# EAGLE design ridici2 (EAGLE 4.11)
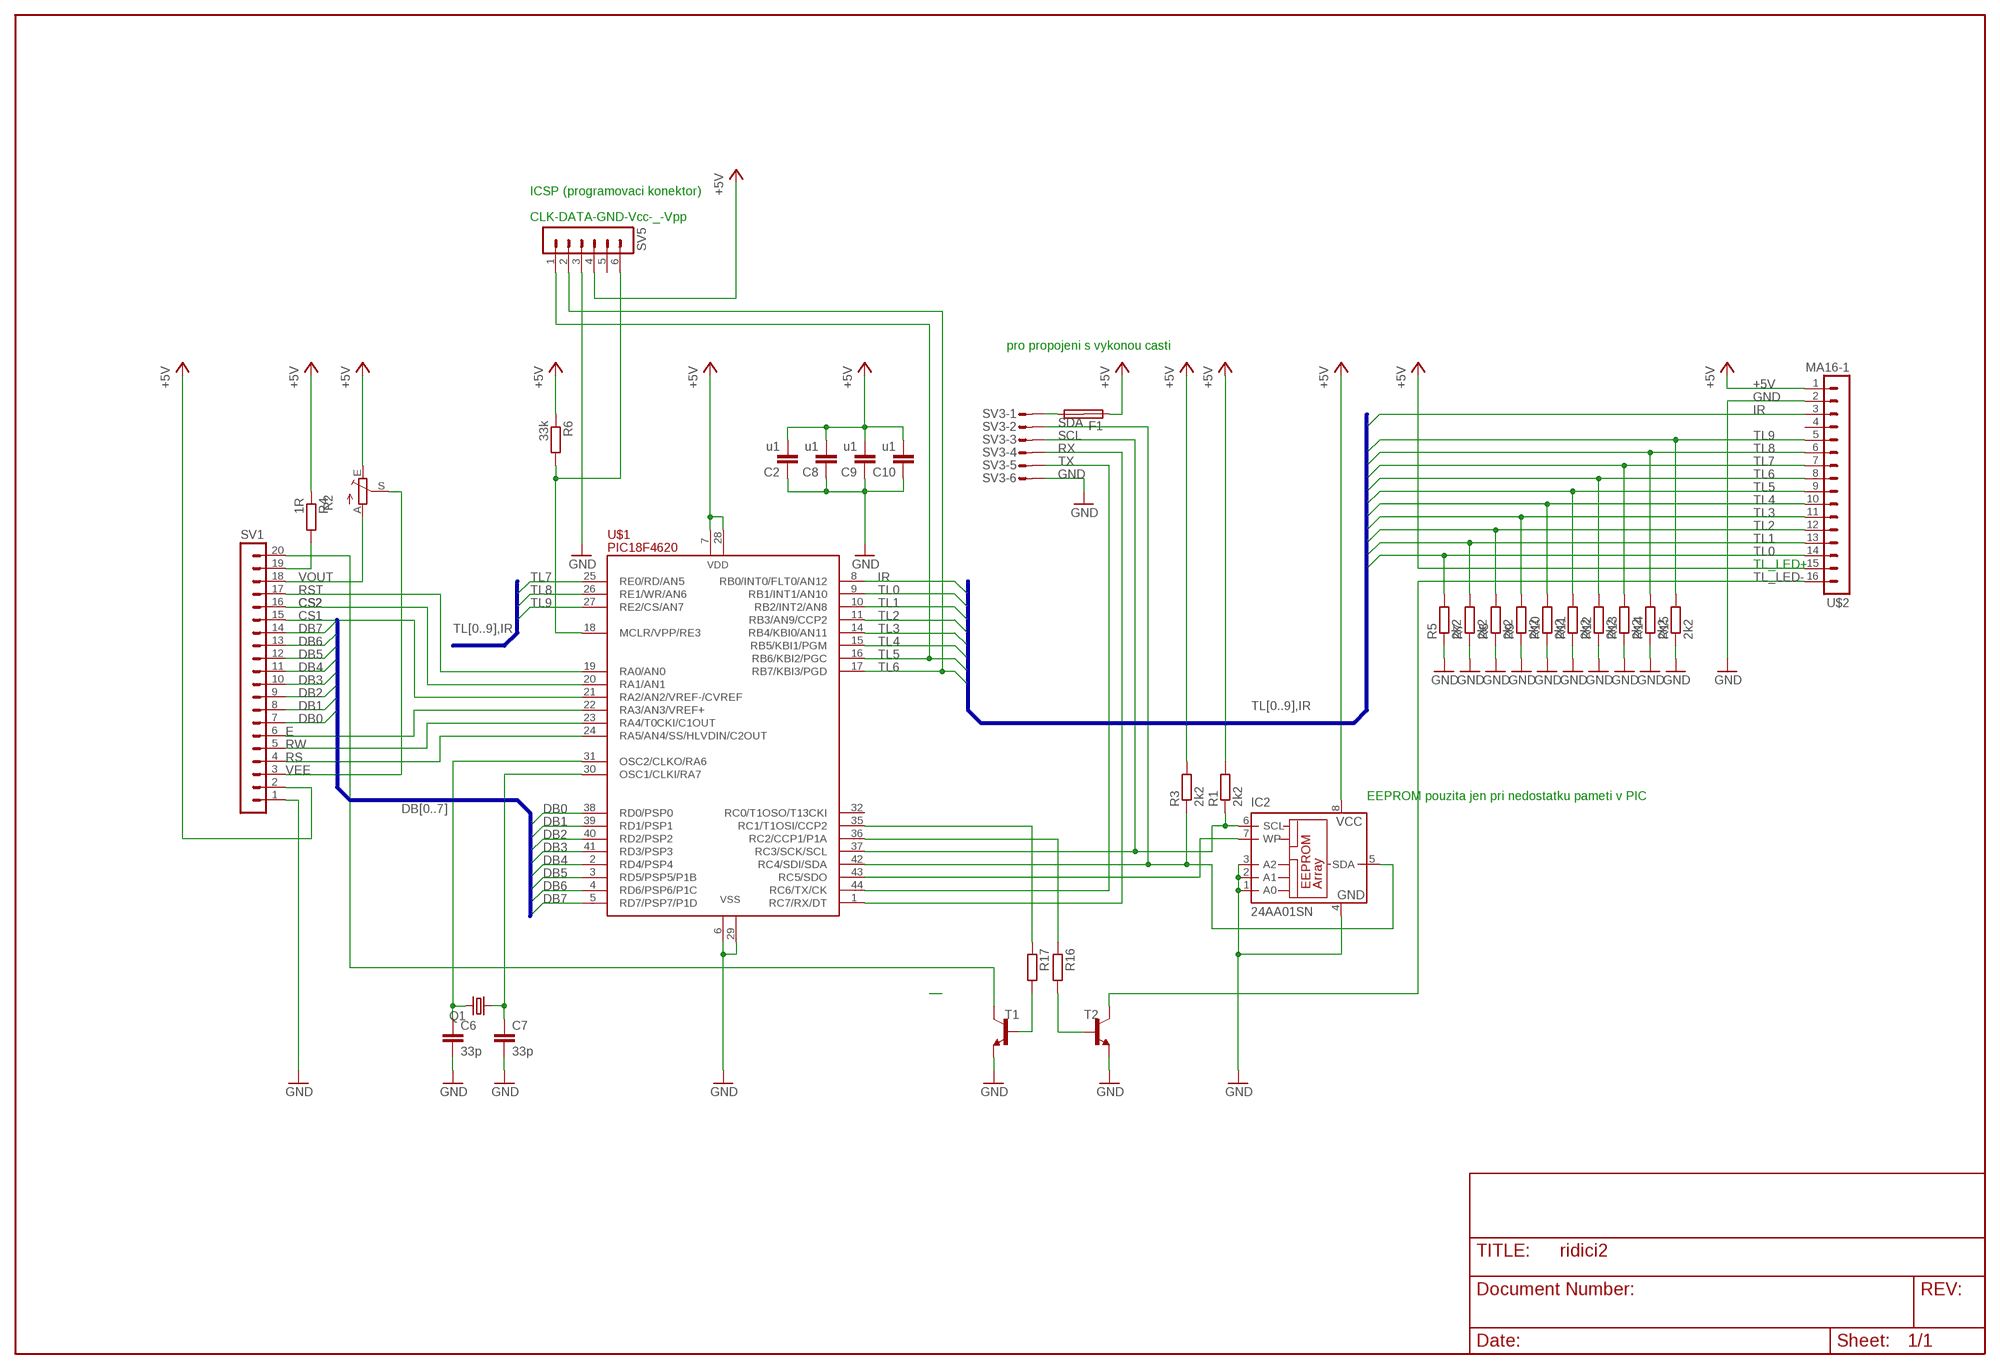
[diagram p0: schematic, sheet 1]

## Parts
C2  u1  C-EUC1206  [C1206]
C6  33p  C-EUC1206  [C1206]
C7  33p  C-EUC1206  [C1206]
C8  u1  C-EUC1206  [C1206]
C9  u1  C-EUC1206  [C1206]
C10  u1  C-EUC1206  [C1206]
F1  SHK20L  [SHK20L]
IC2  24AA01SN  [SO-08]
Q1  CRYTALHC18U-V  [HC18U-V]
R1  2k2  R-EU_0207/10  [0207/10]
R2  TRIM_EU-PT10S  [PT-10S]
R3  2k2  R-EU_0207/10  [0207/10]
R4  1R  R-EU_R1206  [R1206]
R5  2k2  R-EU_0207/10  [0207/10]
R6  33k  R-EU_R1206  [R1206]
R7  2k2  R-EU_0207/10  [0207/10]
R8  2k2  R-EU_0207/10  [0207/10]
R9  2k2  R-EU_0207/10  [0207/10]
R10  2k2  R-EU_0207/10  [0207/10]
R11  2k2  R-EU_0207/10  [0207/10]
R12  2k2  R-EU_0207/10  [0207/10]
R13  2k2  R-EU_0207/10  [0207/10]
R14  2k2  R-EU_0207/10  [0207/10]
R15  2k2  R-EU_0207/10  [0207/10]
R16  R-EU_0207/10  [0207/10]
R17  R-EU_R1206  [R1206]
SV1  MA20-1  [MA20-1]
SV3  L06P  [L06P]
SV5  MA06-1  [MA06-1]
T1  -NPN-SOT23-EBC  [SOT23-EBC]
T2  -NPN-SOT23-EBC  [SOT23-EBC]
U$1  PIC18F4620  [TQFP44]
U$2  MA16-1  [MA16-1]

## Nets
+5V: C2.2 C8.2 C9.2 C10.2 F1.1A IC2.8(VCC) R1.2 R2.E R3.2 R4.1 R6.1 SV1.2 SV5.4 U$1.7(VDD) U$1.28(VDD) U$2.1 U$2.15
CCP1: R16.1 U$1.36(RC2/CCP1/P1A)
CCP2: R17.1 U$1.35(RC1/T1OSI/CCP2)
CS1: SV1.15 U$1.21(RA2/AN2/VREF-/CVREF)
CS2: SV1.16 U$1.20(RA1/AN1)
DB0: SV1.7 U$1.38(RD0/PSP0)
DB1: SV1.8 U$1.39(RD1/PSP1)
DB2: SV1.9 U$1.40(RD2/PSP2)
DB3: SV1.10 U$1.41(RD3/PSP3)
DB4: SV1.11 U$1.2(RD4/PSP4)
DB5: SV1.12 U$1.3(RD5/PSP5/P1B)
DB6: SV1.13 U$1.4(RD6/PSP6/P1C)
DB7: SV1.14 U$1.5(RD7/PSP7/P1D)
E: SV1.6 U$1.22(RA3/AN3/VREF+)
GND: C2.1 C6.2 C7.2 C8.1 C9.1 C10.1 IC2.1(A0) IC2.2(A1) IC2.3(A2) IC2.4(GND) R5.1 R7.1 R8.1 R9.1 R10.1 R11.1 R12.1 R13.1 R14.1 R15.1 SV1.1 SV3.6 SV5.3 T1.E T2.E U$1.6(VSS) U$1.29(VSS) U$2.2
IR: U$1.8(RB0/INT0/FLT0/AN12) U$2.3
N$1: F1.2A SV3.1
N$5: R4.2 SV1.19
N$6: C7.1 Q1.1 U$1.30(OSC1/CLKI/RA7)
N$7: C6.1 Q1.2 U$1.31(OSC2/CLKO/RA6)
N$10: IC2.7(WP) U$1.43(RC5/SDO)
N$13: SV1.20 T1.C
N$14: R6.2 SV5.6 U$1.18(MCLR/VPP/RE3)
N$20: R17.2 T1.B
N$21: R16.2 T2.B
RS: SV1.4 U$1.24(RA5/AN4/SS/HLVDIN/C2OUT)
RST: SV1.17 U$1.19(RA0/AN0)
RW: SV1.5 U$1.23(RA4/T0CKI/C1OUT)
RX: SV3.4 U$1.1(RC7/RX/DT)
SCL: IC2.6(SCL) R1.1 SV3.3 U$1.37(RC3/SCK/SCL)
SDA: IC2.5(SDA) R3.1 SV3.2 U$1.42(RC4/SDI/SDA)
TL0: R5.2 U$1.9(RB1/INT1/AN10) U$2.14
TL1: R7.2 U$1.10(RB2/INT2/AN8) U$2.13
TL2: R8.2 U$1.11(RB3/AN9/CCP2) U$2.12
TL3: R9.2 U$1.14(RB4/KBI0/AN11) U$2.11
TL4: R10.2 U$1.15(RB5/KBI1/PGM) U$2.10
TL5: R11.2 SV5.1 U$1.16(RB6/KBI2/PGC) U$2.9
TL6: R12.2 SV5.2 U$1.17(RB7/KBI3/PGD) U$2.8
TL7: R13.2 U$1.25(RE0/RD/AN5) U$2.7
TL8: R14.2 U$1.26(RE1/WR/AN6) U$2.6
TL9: R15.2 U$1.27(RE2/CS/AN7) U$2.5
TL_LED-: T2.C U$2.16
TX: SV3.5 U$1.44(RC6/TX/CK)
VEE: R2.S SV1.3
VOUT: R2.A SV1.18
Unconnected: F1.1B F1.2B SV5.5 U$1.32(RC0/T1OSO/T13CKI) U$2.4

## Buses
DB[0..7]
TL[0..9],IR

## Notes on the sheet
- ICSP (programovaci konektor)
- CLK-DATA-GND-Vcc-_-Vpp
- pro propojeni s vykonou casti
- TL_LED+
- EEPROM pouzita jen pri nedostatku pameti v PIC

## Library data of the parts
C2 C6-C10 = rcl:C-EU: CAPACITOR, European symbol
F1 = MP3 PREHRAVAC:SHK20L: FUSE HOLDER 5 x 20 mm, SH contact, SHH1 Schukat, E1073 Buerklin
IC2 = microchip:24*: Serial EEPROM I2C
Q1 = MP3 PREHRAVAC:CRYTAL: CRYSTAL
R1 R3-R17 = rcl:R-EU_: RESISTOR, European symbol
R2 = pot:TRIM_EU-: POTENTIOMETER
SV1 = con-lstb:MA20-1: PIN HEADER
SV3 = con-amp-mt:L06P: AMP MT CONNECTOR
SV5 = con-lstb:MA06-1: PIN HEADER
T1 T2 = transistor:*-NPN-: NPN Transistror
U$1 = MP3 PREHRAVAC:PIC18F4620
U$2 = con-lstb:MA16-1

## Board
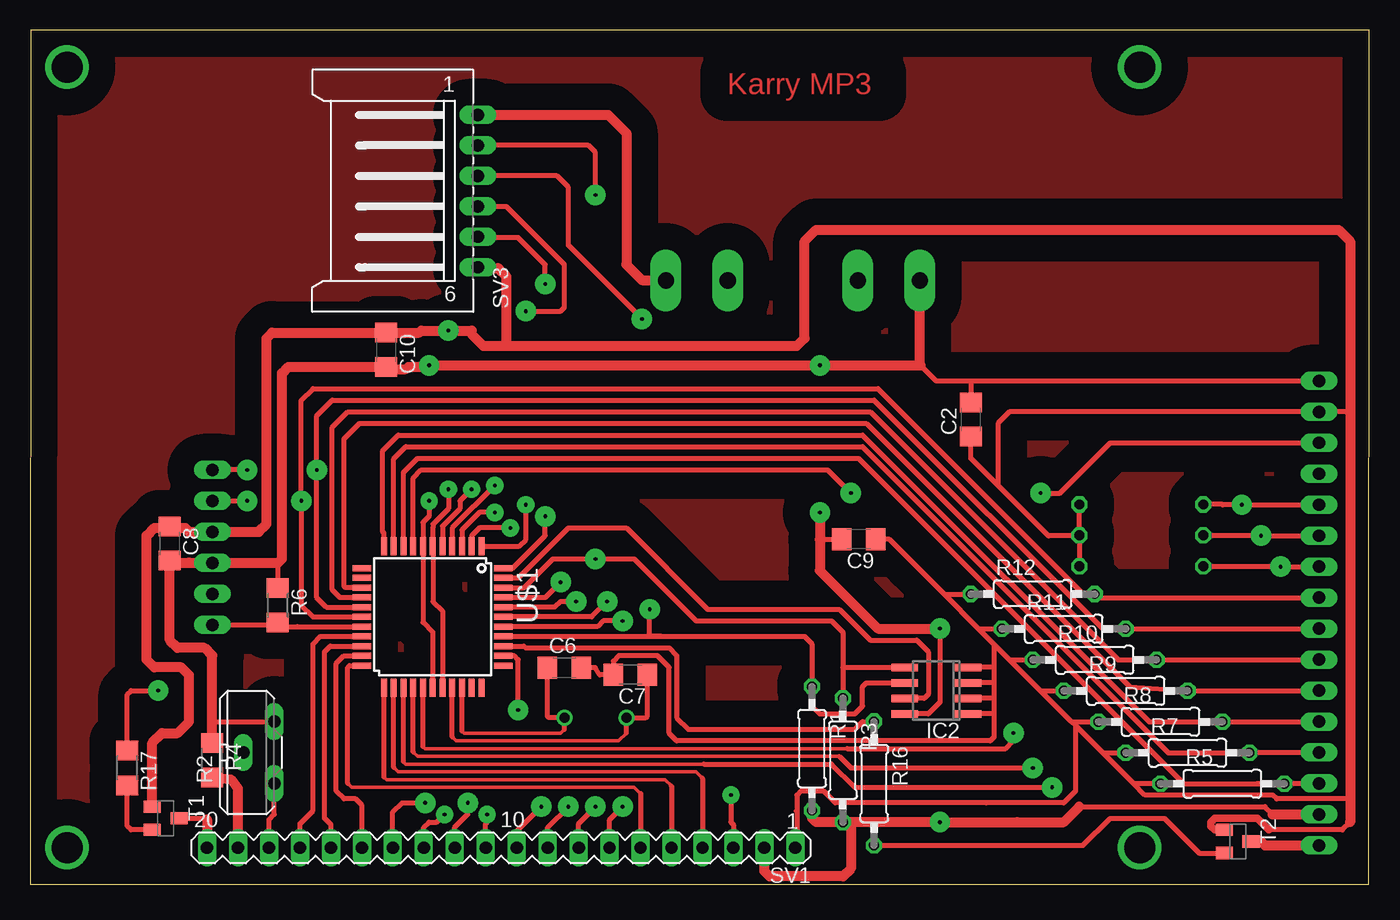
[diagram p1: board, top side]
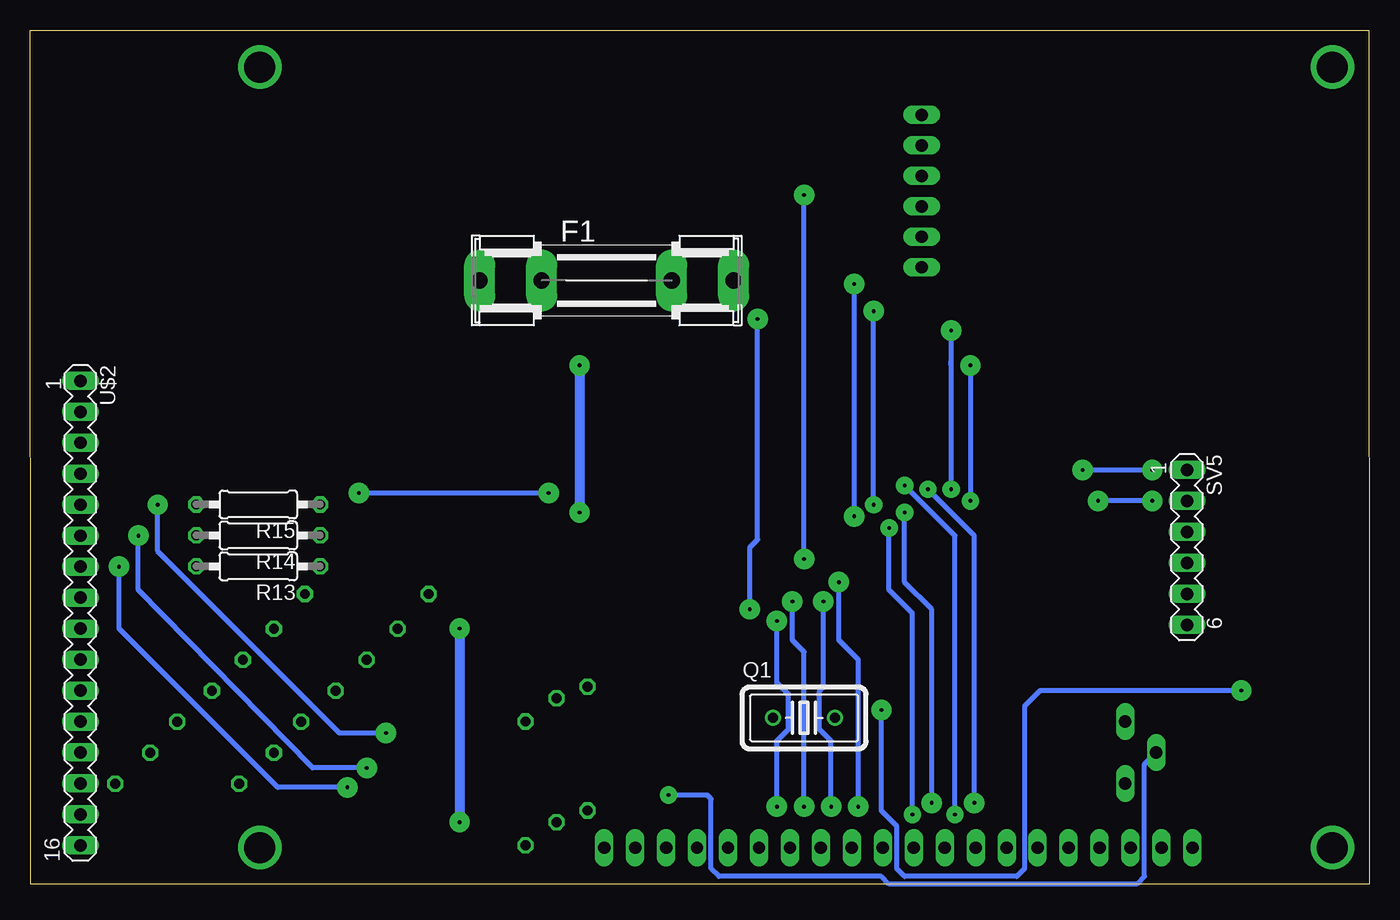
[diagram p2: board, bottom side, seen from below]

Size 109.82 x 70.01 mm. Coordinates in mm from the lower left corner, seen from the top.
Outline: 0,0 109.79,0 109.82,70.01 0.02,70.01 0,0
Copper layers (1*16): Top 0.035mm / dielectric 1.5mm / Bottom 0.035mm
Design rules "default": minimum track width 10mil, minimum drill 24mil, track to track 8mil, track to pad 8mil, pad to pad 8mil, via to via 8mil, smd to smd 8mil, copper to edge 40mil, drill to drill 8mil, minimum pad ring 10mil, minimum via ring 8mil, stop-mask expansion 4mil, vias tented up to drill 0mil, thermal gap 10mil

### Footprints (pad centres in the part's own frame; a part is rotated, then mirrored left to right if it is on the bottom)
C1206 = smd 1.6 x 1.8: 1 -1.4,0; 2 1.4,0
SHK20L = drill 1.321 pad 2.54 long: 1A -10.414,0; 1B -5.334,0; 2A 10.414,0; 2B 5.334,0
SO-08 = smd 0.6 x 2.2: 1 -1.905,-2.6; 2 -0.635,-2.6; 3 0.635,-2.6; 4 1.905,-2.6; 5 1.905,2.6; 6 0.635,2.6; 7 -0.635,2.6; 8 -1.905,2.6
HC18U-V = drill 0.813 round: 1 -2.54,0; 2 2.54,0
0207/10 = drill 0.813 octagon: 1 -5.08,0; 2 5.08,0
PT-10S = drill 1.016 long: A -2.54,-1.27; E 2.54,-1.27; S 0,1.27
R1206 = smd 1.6 x 1.803: 1 -1.422,0; 2 1.422,0
MA20-1 = drill 1.016 long: 1 -24.13,0; 2 -21.59,0; 3 -19.05,0; 4 -16.51,0; 5 -13.97,0; 6 -11.43,0; 7 -8.89,0; 8 -6.35,0; 9 -3.81,0; 10 -1.27,0; 11 1.27,0; 12 3.81,0; 13 6.35,0; 14 8.89,0; 15 11.43,0; 16 13.97,0; 17 16.51,0; 18 19.05,0; 19 21.59,0; 20 24.13,0
L06P = drill 1.016 long: 1 6.25,-6.25; 2 3.75,-6.25; 3 1.25,-6.25; 4 -1.25,-6.25; 5 -3.75,-6.25; 6 -6.25,-6.25
MA06-1 = drill 1.016 long: 1 -6.35,0; 2 -3.81,0; 3 -1.27,0; 4 1.27,0; 5 3.81,0; 6 6.35,0
SOT23-EBC = smd 1 x 1.4: B 0.95,-1.1; C 0,1.1; E -0.95,-1.1
TQFP44 = smd 1.5 x 0.5: 1 -5.8,4; 2 -5.8,3.2; 3 -5.8,2.4; 4 -5.8,1.6; 5 -5.8,0.8; 6 -5.8,0; 7 -5.8,-0.8; 8 -5.8,-1.6; 9 -5.8,-2.4; 10 -5.8,-3.2; 11 -5.8,-4; 23 5.8,-4; 24 5.8,-3.2; 25 5.8,-2.4; 26 5.8,-1.6; 27 5.8,-0.8; 28 5.8,0; 29 5.8,0.8; 30 5.8,1.6; 31 5.8,2.4; 32 5.8,3.2; 33 5.8,4 | smd 0.5 x 1.5: 12 -4,-5.8; 13 -3.2,-5.8; 14 -2.4,-5.8; 15 -1.6,-5.8; 16 -0.8,-5.8; 17 0,-5.8; 18 0.8,-5.8; 19 1.6,-5.8; 20 2.4,-5.8; 21 3.2,-5.8; 22 4,-5.8; 34 4,5.8; 35 3.2,5.8; 36 2.4,5.8; 37 1.6,5.8; 38 0.8,5.8; 39 0,5.8; 40 -0.8,5.8; 41 -1.6,5.8; 42 -2.4,5.8; 43 -3.2,5.8; 44 -4,5.8
MA16-1 = drill 1.016 long: 1 -19.05,0; 2 -16.51,0; 3 -13.97,0; 4 -11.43,0; 5 -8.89,0; 6 -6.35,0; 7 -3.81,0; 8 -1.27,0; 9 1.27,0; 10 3.81,0; 11 6.35,0; 12 8.89,0; 13 11.43,0; 14 13.97,0; 15 16.51,0; 16 19.05,0

### Placement (x,y rotation side)
C2  77.15,38.1 90 top
C6  43.81,17.76 0 top
C7  49.22,17.17 180 top
C8  11.41,27.94 270 top
C9  67.95,28.28 180 top
C10  29.19,43.82 270 top
F1  62.54,49.51 0 bottom
IC2  74.32,15.87 90 top
Q1  46.35,13.63 0 bottom
R1  64.11,11.12 270 top
R2  18.73,10.79 90 top
R3  66.65,10.16 270 top
R4  14.9,10.16 270 top
R5  97.78,8.23 0 top
R6  20.3,22.86 270 top
R7  94.93,10.77 0 top
R8  92.7,13.31 0 top
R9  89.85,15.85 0 top
R10  87.31,18.39 0 top
R11  84.77,20.93 0 top
R12  82.23,23.79 0 top
R13  91.13,26.06 180 bottom
R14  91.13,28.6 180 bottom
R15  91.13,31.14 180 bottom
R16  69.21,8.25 270 top
R17  7.94,9.52 270 top
SV1  38.62,2.98 180 top
SV3  30.46,56.84 90 top
SV5  14.94,27.62 270 bottom
T1  11.09,5.4 270 top
T2  99.04,3.5 270 top
U$1  33,21.91 270 top
U$2  105.73,22.22 270 bottom

### Tracks (layer width: path | path; a pad name or v marks a point on that pad's centre or on a via)
+5V  (via drill 0.3 pad 1.42, 0.3 pad 1.68)
  Top 0.406: U$1.28 33,20.66 32.2,21.46 U$1.7 32.2,29.66 32.7,30.16 v32.7,31.43 | 64.13,6.04 64.11,6.05 R1.2 64.13,6.04 | IC2.8 73.65,13.96 74.61,14.92 v74.61,20.95 | 80.96,5.08 81.28,5.08 | 67.31,5.08 67.3,5.08 R3.2 | 64.13,6.04 64.13,6.03 64.13,5.4 | 101.92,5.71 101.28,6.35 86.04,6.35 | 77.15,41.27 74.29,41.27 73.02,42.54 72.95,42.61 | 77.15,41.27 U$2.1 | 32.58,42.42 v32.7,42.54 | 12.82,26.54 13.02,26.35 12.99,26.37 | 20.3,26.33 R6.1 | 77.15,41.27 C2.2 | 30.8,42.23 30.99,42.42 | C10.2 29.19,42.25 29.21,42.23 29.02,42.42 | C9.2 64.79,28.28 64.77,28.26 | C8.2 11.41,26.37 11.43,26.35 | 14.92,13.33 R2.E | 14.92,26.35 14.94,26.33 SV5.4 14.93,26.35 14.92,26.35
  Top 0.813: R4.1 14.76,11.9 14.92,12.06 14.92,13.33 14.92,18.73 14.29,19.37 12.06,19.37 11.43,20 11.43,26.35 | SV1.2 60.21,1.07 60.64,0.63 66.67,0.63 67.31,1.27 67.31,5.08 v74.61,5.08 80.96,5.08 84.77,5.08 86.04,6.35 | R3.2 64.45,5.08 64.13,5.4 | 101.92,5.71 U$2.15 | 72.95,42.61 F1.1A | v32.7,42.54 v64.77,42.54 73.02,42.54 | 13.02,26.35 14.92,26.35 20.32,26.35 | v74.61,20.95 69.53,20.95 64.77,25.72 64.77,28.26 v64.77,30.48 | 30.99,42.42 32.58,42.42 | 29.21,42.23 30.8,42.23 | 29.02,42.42 21.15,42.42 20.64,41.91 20.64,26.67 20.32,26.35 | 11.41,26.37 12.99,26.37 | 20.32,26.35 20.3,26.33
  Bottom 0.406: v32.7,42.54 v32.7,31.43
  Bottom 0.813: v64.77,42.54 v64.77,30.48 | v74.61,20.95 v74.61,5.08
CCP1
  Top 0.406: R16.1 68.26,13.33 67.63,12.7 53.97,12.7 53.02,13.65 53.02,18.73 52.39,19.37 40.64,19.37 40.49,19.51 U$1.36
CCP2  (via drill 0.3 pad 1.68)
  Top 0.406: U$1.35 39.71,18.71 40,18.41 v40,14.29 | v10.48,15.87 8.25,15.87 7.94,15.56 R17.1
  Bottom 0.406: v10.48,15.87 26.99,15.87 28.26,14.6 28.26,1.27 28.89,0.63 38.1,0.63 38.73,1.27 38.73,4.76 40,6.03 v40,14.29
CS1
  Top 0.406: U$1.21 25.7,18.71 25.08,18.1 25.08,7.62 25.72,6.98 26.67,6.98 27.19,6.46 SV1.15
CS2
  Top 0.406: SV1.16 24.65,4.88 24.13,5.4 24.13,19.05 24.59,19.51 U$1.20
DB0  (via drill 0.3 pad 1.68)
  Top 0.406: SV1.7 47.51,5.28 v48.58,6.35 | v48.58,21.59 46.99,21.59 46.51,21.11 U$1.38
  Bottom 0.406: v48.58,6.35 48.58,11.75 47.62,12.7 47.62,15.56 48.58,16.51 v48.58,21.59
DB1  (via drill 0.3 pad 1.68)
  Top 0.406: SV1.8 44.97,4.96 v46.35,6.35 | U$1.39 46.04,21.91 v47.31,23.18
  Bottom 0.406: v46.35,6.35 46.35,19.05 47.31,20 v47.31,23.18
DB2  (via drill 0.3 pad 1.68)
  Top 0.406: U$1.40 43.01,22.71 43.5,23.18 v44.77,23.18 | SV1.9 42.43,4.65 v44.13,6.35
  Bottom 0.406: v44.13,6.35 44.13,11.75 45.08,12.7 45.08,15.87 44.77,16.19 v44.77,23.18
DB3  (via drill 0.3 pad 1.68)
  Top 0.406: SV1.10 39.89,4.33 v41.91,6.35 | v43.5,24.76 42.23,23.49 39.05,23.49 39.03,23.51 U$1.41
  Bottom 0.406: v41.91,6.35 41.91,18.41 43.5,20 v43.5,24.76
DB4  (via drill 0.3 pad 1.42)
  Top 0.406: SV1.11 37.35,4.96 37.46,5.08 v37.46,5.71 | U$1.2 36.2,27.94 36.19,27.94 36.19,28.57 36.83,29.21 v39.37,29.21
  Bottom 0.406: v37.46,5.71 37.46,22.22 39.37,24.13 v39.37,29.21
DB5  (via drill 0.3 pad 1.42, 0.3 pad 1.68)
  Top 0.406: SV1.12 34.81,4.65 35.88,5.71 v35.88,6.67 | v38.1,30.48 36.83,30.48 35.4,29.05 U$1.3
  Bottom 0.406: v35.88,6.67 35.88,22.54 38.1,24.76 v38.1,30.48
DB6  (via drill 0.3 pad 1.42)
  Top 0.406: SV1.13 32.27,4.65 32.7,5.08 33.34,5.08 v33.97,5.71 | U$1.4 34.6,27.93 34.61,27.94 34.61,29.21 v38.1,32.7
  Bottom 0.406: v33.97,5.71 33.97,28.57 v38.1,32.7
DB7  (via drill 0.3 pad 1.42, 0.3 pad 1.68)
  Top 0.406: SV1.14 29.73,5.92 30.48,6.67 v32.38,6.67 | U$1.5 33.8,29.35 35.24,30.8 35.24,31.43 v36.19,32.38
  Bottom 0.406: v32.38,6.67 32.38,28.57 v36.19,32.38
E
  Top 0.305: 26.03,8.25 26.35,7.94 49.53,7.94 50.05,7.42
  Top 0.406: U$1.22 26.17,17.91 26.03,17.78 26.03,8.25 | 50.05,7.42 SV1.6
GND  (via drill 0.3 pad 1.42, 0.3 pad 1.68)
  Top 0.406: U$1.29 33.8,22.4 33.02,23.18 33.02,27.3 33,27.33 U$1.6 33,29.23 33.02,29.21 33.02,29.53 34.29,30.8 v34.29,32.38 | C6.2 46.33,17.76 46.69,17.17 C7.2 47.82,18.29 48.26,18.73 51.43,18.73 52.39,17.78 52.39,12.38 53.02,11.75 78.74,11.75 79.06,12.06 79.06,13.97 | IC2.4 79.05,17.77 79.06,17.78 | 79.06,17.78 79.06,16.51 | 76.92,16.43 76.83,16.51 | 76.92,16.43 IC2.3 | 79.06,16.51 77.15,16.51 76.92,16.43 | IC2.2 79.05,15.23 79.06,15.24 | 79.06,16.51 79.06,15.24 | 79.05,13.96 IC2.1 | 79.06,13.97 79.05,13.96 | 79.06,15.24 79.06,13.97 | 78.42,6.67 78.4,6.64 | 79.05,13.96 79.06,13.96 79.06,13.97 | 78.42,6.67 66.04,6.67 65.11,7.6 63.16,7.6 62.86,7.3 62.86,6.03 | SV1.1 62.35,2.98 62.86,3.49 62.86,6.03 | 77.79,20.95 74.93,23.81 | 80.33,18.41 79.06,19.68 | 79.06,19.68 77.79,20.95 | 82.87,15.87 80.33,18.41 | 85.41,13.33 82.87,15.87 | 87.95,10.79 85.72,13.02 | 85.72,13.02 85.41,13.33 | 74.93,23.81 74.61,24.13 | 74.61,24.13 | 92.7,7.94 92.71,7.94 | 92.7,7.94 R5.1 | 92.7,7.94 92.39,8.25 90.49,8.25 | R12.1 74.95,23.79 74.93,23.81 | R11.1 77.81,20.93 77.79,20.95 | R10.1 80.35,18.39 80.33,18.41 | R9.1 82.89,15.85 82.87,15.87 | R8.1 85.43,13.31 85.41,13.33 | R7.1 87.97,10.77 87.95,10.79 | 79.06,19.68 79.06,17.78 | 101.6,4.44 107.63,4.44 108.27,5.08 | 108.42,38.26 108.27,38.73 108.11,38.26 108.42,38.26 | 108.42,38.26 107.95,38.73 106.04,38.73 105.73,38.42 U$2.2 80.33,38.73 79.37,37.78 79.37,32.7 | 79.37,32.7 83.5,28.57 | 83.5,28.57 83.52,28.55 | 90.49,8.25 87.95,10.79 | 90.49,8.25 91.44,7.3 101.92,7.3 102.23,6.98 108.27,6.98 | v34.29,45.4 34.11,45.22 | 14.92,28.89 14.93,28.89 SV5.3 | 74.61,24.13 72.39,26.35 | 72.39,26.35 72.41,26.33 | 36.26,45.02 36.26,45.15 36.19,45.4
  Top 0.406: C2.1 77.15,34.92 79.37,32.7 | C10.1 29.03,45.22 28.89,45.08 28.76,45.22 | 31.88,45.22 32.07,45.4 | C9.1 70.46,28.28 72.39,26.35 | C8.1 11.41,29.23 11.43,29.21 11.29,29.34 | 78.42,6.67 84.77,6.67 85.72,7.62 85.72,13.02 | 62.86,6.03 62.84,6.01 | R13.1 86.05,28.57 86.04,28.57 86.05,28.58 R14.1 | R14.1 R15.1 | R14.1 83.52,28.6 83.5,28.57
  Top 0.61: T2.E 97.15,4.45 96.84,4.76 96.84,5.08 97.15,5.4 100.65,5.4 101.6,4.44
  Top 0.813: 108.27,5.08 108.27,6.98 108.27,38.73 108.27,52.7 107.31,53.66 64.45,53.66 63.5,52.7 63.5,44.77 62.86,44.13 39.05,44.13 | 36.26,45.02 37.15,44.13 39.05,44.13 | 36.19,45.4 v34.29,45.4 32.07,45.4 | 28.76,45.22 19.82,45.22 19.37,44.77 19.37,29.53 18.73,28.89 14.92,28.89 13.02,28.89 12.7,29.21 11.43,29.21 10.16,29.21 9.52,28.57 9.52,18.41 10.16,17.78 12.38,17.78 13.02,17.14 13.02,13.33 12.06,12.38 10.79,12.38 9.99,11.58 T1.E | C10.1 31.88,45.22 | 39.05,44.13 39.05,49.85 38.42,50.48 | 38.42,50.48 38.35,50.55 | SV3.6 36.62,50.59 36.51,50.48 38.42,50.48
  Bottom 0.406: 34.29,42.54 v34.29,32.38 | 34.29,42.54 34.29,42.86 | v34.29,45.4 34.29,42.54
IR  (via drill 0.3 pad 1.68)
  Top 0.406: U$2.3 88.58,36.19 84.45,32.07 v82.87,32.07 | U$1.8 31.4,33.3 32.07,33.97 65.4,33.97 v67.31,32.07
  Bottom 0.406: v67.31,32.07 v82.87,32.07
N$1
  Top 0.406: 52.07,49.53 52.09,49.51 F1.2A
  Top 0.813: 52.07,49.53 50.16,49.53 48.89,50.8 48.89,61.59 47.4,63.09 SV3.1
N$5
  Top 0.813: SV1.19 17.03,7.82 16.49,8.55 R4.2
N$6
  Top 0.305: 34.6,12.07 34.92,11.75 48.26,11.75 48.89,12.38
  Top 0.406: 34.6,12.07 U$1.30 | 48.89,12.38 48.89,13.65 | C7.1 50.62,13.79 50.48,13.65 48.89,13.65 | 48.89,13.65 Q1.1
N$7
  Top 0.305: 35.4,12.54 35.56,12.38 43.5,12.38 43.81,12.7
  Top 0.406: 35.4,12.54 U$1.31 | 43.81,12.7 43.81,13.65 | C6.1 42.41,13.79 42.54,13.65 43.81,13.65 | 43.81,13.65 Q1.2
N$10
  Top 0.406: IC2.7 73.34,15.23 73.66,15.56 73.66,19.05 72.71,20 68.9,20 66.36,22.54 55.56,22.54 48.89,29.21 44.13,29.21 40.03,25.11 U$1.43
N$13
  Top 0.406: 14.6,5.4 14.49,5.28 14.4,5.28 14.29,5.4 12.38,5.4 T1.C
  Top 0.813: 14.49,5.28 SV1.20
N$14
  Top 0.406: 20.64,21.27 20.61,21.25 | U$1.18 21.91,21.11 20.8,21.11 20.64,21.27 | 20.32,21.27 20.3,21.29 R6.2 | SV5.6 20.31,21.27 20.32,21.27 | 20.32,21.27 20.64,21.27
N$16  (via drill 2.54)
  other vias: 3,67
N$17  (via drill 2.54)
  other vias: 3,3
N$18  (via drill 2.54)
  other vias: 91,3
N$19  (via drill 2.54)
  other vias: 91,67
N$20
  Top 0.406: R17.2 7.94,4.76 8.25,4.44 9.84,4.44 9.85,4.45 T1.B
N$21
  Top 0.406: R16.2 86.36,3.17 88.58,5.4 93.03,5.4 95.88,2.54 97.79,2.54 97.8,2.55 T2.B
N$22
  pour Top (isolate 2.184): 0,0 109.22,0 109.22,69.85 0,69.85
RS
  Top 0.305: 29.8,9.57 30.16,9.21 54.61,9.21 55.13,8.69
  Top 0.406: 29.8,9.57 U$1.24 | 55.13,8.69 SV1.4
RST
  Top 0.406: U$1.19 23.8,20.31 23.18,19.68 23.18,6.03 22.11,4.96 SV1.17
RW
  Top 0.305: 29,8.78 29.21,8.57 52.07,8.57 52.59,8.05
  Top 0.406: 29,8.78 U$1.23 | 52.59,8.05 SV1.5
RX  (via drill 0.3 pad 1.42, 0.3 pad 1.68)
  Top 0.406: U$1.1 40.09,27.71 40.64,28.26 v40.64,31.11 | v40.64,46.99 43.5,46.99 43.81,47.31 43.81,50.8 39.05,55.56 36.83,55.56 36.8,55.59 SV3.4
  Bottom 0.406: v40.64,31.11 v40.64,46.99
SCL  (via drill 0.3 pad 1.68)
  Top 0.406: U$1.37 50.8,20.31 | 50.8,20.31 51.75,20.31 | 51.75,20.31 62.86,20.31 | 62.86,20.31 62.87,20.31 | 62.86,20.31 62.86,20.32 63.5,20.32 64.11,19.71 R1.1 64.13,16.2 64.13,16.19 64.13,14.6 64.77,13.97 67.63,13.97 68.26,14.6 68.26,16.19 68.57,16.5 IC2.6 | SV3.3 43.19,58.09 44.13,57.15 44.13,52.39 v50.16,46.35 | 50.8,20.31 50.8,20.32 | 51.75,20.31 50.81,20.31 50.8,20.32 | 50.8,20.32 v50.8,22.54
  Bottom 0.406: v50.16,46.35 50.16,28.26 50.8,27.62 v50.8,22.54
SDA  (via drill 0.3 pad 1.68)
  Top 0.406: 66.65,17.78 R3.1 66.67,15.24 | U$1.42 40.5,24.31 42.86,26.67 v46.35,26.67 49.53,26.67 54.61,21.59 65.72,21.59 66.65,20.66 66.65,17.78 | 66.65,17.78 67.31,17.78 67.31,17.77 IC2.5 | SV3.2 45.77,60.59 46.35,60.01 v46.35,56.51
  Bottom 0.406: v46.35,26.67 v46.35,56.51
TL0
  Top 0.406: U$2.14 102.55,8.25 100.64,8.25 R5.2 94.64,8.23 67.94,34.92 31.75,34.92 30.6,33.77 U$1.9
TL1
  Top 0.406: U$2.13 100.01,10.79 R7.2 93.37,10.77 68.26,35.88 30.8,35.88 29.8,34.88 U$1.10
TL2
  Top 0.406: U$1.11 29,28.79 28.89,28.89 28.89,35.56 30.16,36.83 68.26,36.83 91.78,13.31 R8.2 97.78,13.33 97.79,13.33 U$2.12
TL3
  Top 0.406: U$2.11 94.93,15.87 R9.2 90.19,16.17 68.58,37.78 26.99,37.78 25.72,36.51 25.72,24.45 25.85,24.31 U$1.14
TL4
  Top 0.406: U$2.10 92.07,18.41 92.1,18.39 R10.2 89.24,18.39 68.9,38.73 26.03,38.73 24.76,37.46 24.76,24.13 25.38,23.51 U$1.15
TL5  (via drill 0.3 pad 1.68)
  Top 0.406: U$2.9 105.41,20.95 105.39,20.93 R11.2 87.97,20.93 69.21,39.69 24.76,39.69 23.49,38.42 v23.49,33.97 23.49,23.49 24.28,22.71 U$1.16 | SV5.1 14.93,33.97 14.92,33.97 v17.78,33.97
  Bottom 0.406: v23.49,33.97 v17.78,33.97
TL6  (via drill 0.3 pad 1.68)
  Top 0.406: U$2.8 87.63,23.49 87.31,23.81 R12.2 86.38,23.79 69.53,40.64 23.18,40.64 22.22,39.69 v22.22,31.43 22.22,22.86 23.18,21.91 26.99,21.91 U$1.17 | SV5.2 14.93,31.43 14.92,31.43 v17.78,31.43
  Bottom 0.406: v17.78,31.43 v22.22,31.43
TL7  (via drill 0.3 pad 1.68)
  Top 0.305: 30.6,10.04 30.8,9.84 55.24,9.84
  Top 0.406: 30.6,10.04 U$1.25 | 55.24,9.84 65.72,9.84 67.63,7.94 v83.82,7.94 | U$2.7 v102.55,26.03 96.2,26.03 96.21,26.04 R13.2
  Bottom 0.406: v83.82,7.94 89.53,7.94 102.55,20.95 v102.55,26.03
TL8  (via drill 0.3 pad 1.68)
  Top 0.305: 31.4,10.83 31.75,10.48 66.36,10.48
  Top 0.406: 31.4,10.83 U$1.26 | 66.36,10.48 67.31,9.52 v82.23,9.52 | v100.96,28.57 101.26,28.55 | v100.96,28.57 U$2.6 | R14.2 96.21,28.58 96.2,28.57 v100.96,28.57
  Bottom 0.406: v100.96,28.57 100.96,24.13 86.68,9.52 v82.23,9.52
TL9  (via drill 0.3 pad 1.68)
  Top 0.305: 32.2,11.3 32.38,11.11 66.99,11.11
  Top 0.406: 32.2,11.3 U$1.27 | 66.99,11.11 80.01,11.11 80.64,11.75 v80.64,12.38 | 97.79,31.11 97.78,31.11 | 97.79,31.11 v99.38,31.11 99.4,31.09 105.7,31.09 U$2.5 | R15.2 97.77,31.14 97.79,31.11
  Bottom 0.406: v80.64,12.38 84.45,12.38 99.38,27.3 v99.38,31.11
TL_LED-
  Top 0.406: T2.C 100.32,3.5 100.33,3.49 100.96,3.49
  Top 0.813: U$2.16 101.28,3.17 100.96,3.49
TX  (via drill 0.3 pad 1.68)
  Top 0.406: U$1.44 39.56,25.91 42.23,28.57 v42.23,30.16 | v42.23,49.21 42.23,50.8 40,53.02 36.83,53.02 36.76,53.09 SV3.5
  Bottom 0.406: v42.23,30.16 v42.23,49.21
VEE  (via drill 0.3 pad 1.42)
  Top 0.406: SV1.3 57.67,4.88 57.47,5.08 v57.47,7.3
  Bottom 0.406: v57.47,7.3 54.29,7.3 53.97,6.98 53.97,1.27 53.34,0.63 40,0.63 39.37,0 19.05,0 18.41,0.63 18.41,9.84 R2.S
VOUT
  Top 0.406: SV1.18 19.57,5.28 20,5.71 20,7.94 20.32,8.25 R2.A

### Text on the board
Top: Karry MP3
tValues: SMD soucastky napajet zezhora, ostatni "zezadu" (netyka se konektoru na tlacitka a LCD) | modra vrstva jsou propojky